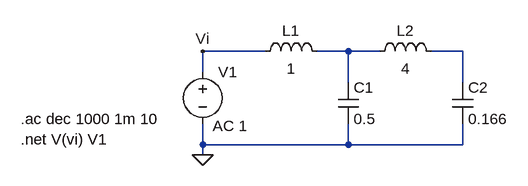
[diagram p0: schematic cauer_oo.asc]
cauer_oo.asc, the LTspice schematic file:
Version 4
SHEET 1 880 680
WIRE 176 160 80 160
WIRE 304 160 256 160
WIRE 352 160 304 160
WIRE 480 160 432 160
WIRE 80 192 80 160
WIRE 304 208 304 160
WIRE 480 208 480 160
WIRE 80 304 80 272
WIRE 304 304 304 272
WIRE 304 304 80 304
WIRE 480 304 480 272
WIRE 480 304 304 304
WIRE 80 320 80 304
FLAG 80 320 0
FLAG 80 160 Vi
SYMBOL ind 160 176 R270
WINDOW 0 32 56 VTop 2
WINDOW 3 5 56 VBottom 2
SYMATTR InstName L1
SYMATTR Value 1
SYMATTR SpiceLine Rser=0
SYMBOL ind 336 176 R270
WINDOW 0 32 56 VTop 2
WINDOW 3 5 56 VBottom 2
SYMATTR InstName L2
SYMATTR Value 4
SYMATTR SpiceLine Rser=0
SYMBOL cap 288 208 R0
SYMATTR InstName C1
SYMATTR Value 0.5
SYMBOL cap 464 208 R0
SYMATTR InstName C2
SYMATTR Value 0.166
SYMBOL voltage 80 176 R0
WINDOW 123 15 99 Left 2
WINDOW 39 0 0 Left 0
SYMATTR InstName V1
SYMATTR Value ""
SYMATTR Value2 AC 1
TEXT -200 264 Left 2 !.ac dec 1000 1m 10
TEXT -200 296 Left 2 !.net V(vi) V1

The netlist it stands for:
* cauer_oo.asc
L1 Vi N001 1 Rser=0
L2 N001 N002 4 Rser=0
C1 N001 0 0.5
C2 N002 0 0.166
V1 Vi 0 AC 1
.ac dec 1000 1m 10
.net V(vi) V1
.backanno
.end